# EAGLE design pcb-bldc-drive (EAGLE 9.6.2)
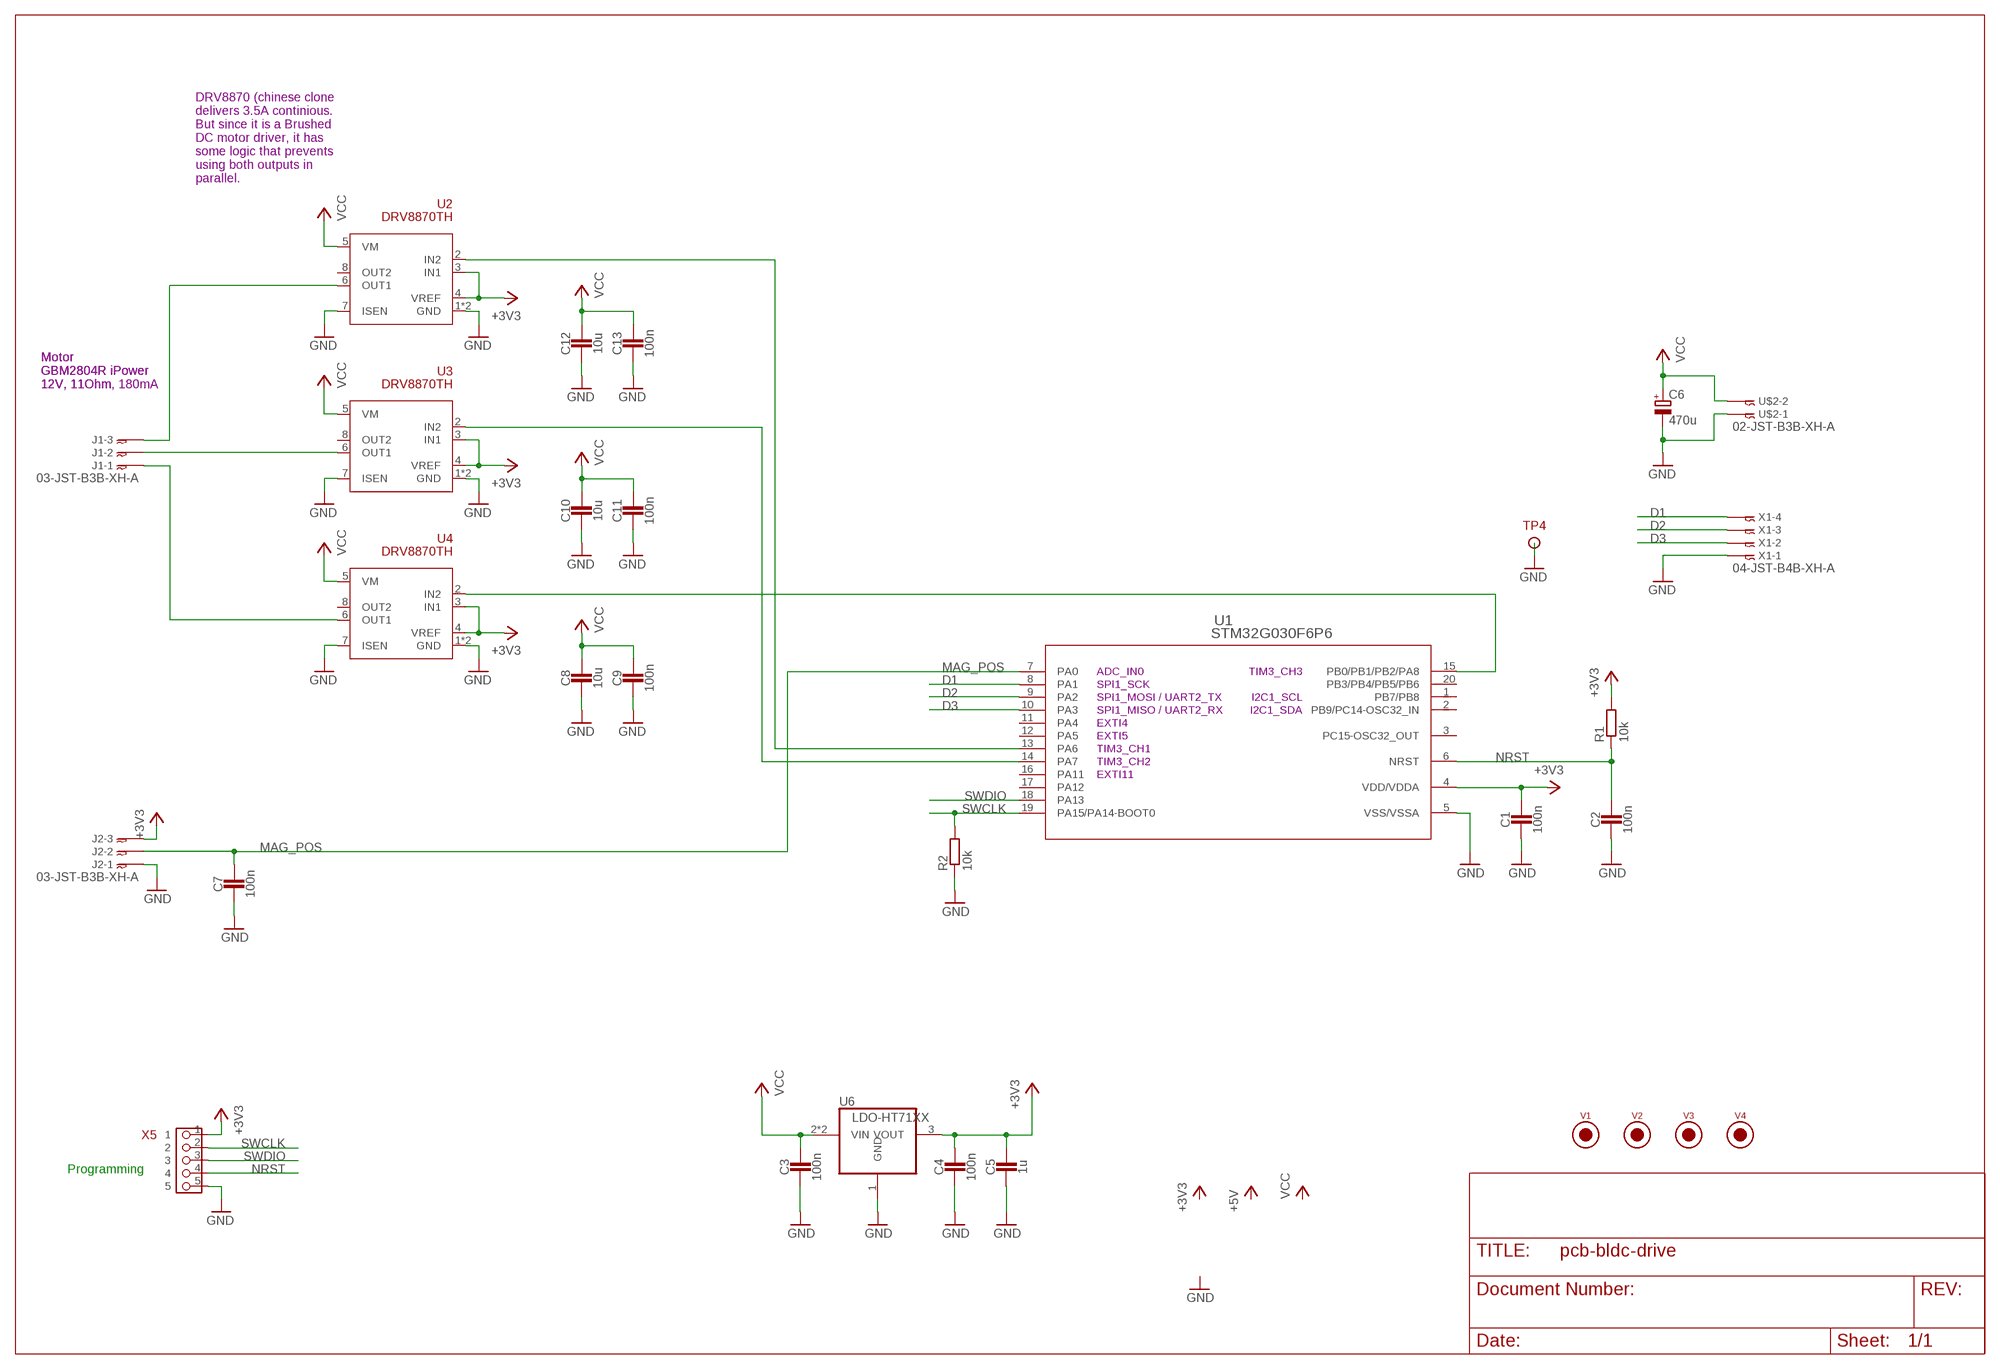
[diagram p0: schematic, sheet 1]

## Parts
C1  100n  CAPACITOR0603_CAP  [0603_CAP]
C2  100n  CAPACITOR0603_CAP  [0603_CAP]
C3  100n  CAPACITOR0603_CAP  [0603_CAP]
C4  100n  CAPACITOR0603_CAP  [0603_CAP]
C5  1u  CAPACITOR0603_CAP  [0603_CAP]
C6  470u  CPOL-EU153CLV-1010  [153CLV-1010]
C7  100n  CAPACITOR0603_CAP  [0603_CAP]
C8  10u  CAPACITOR1206_CAP  [1206_CAP]
C9  100n  CAPACITOR0603_CAP  [0603_CAP]
C10  10u  CAPACITOR1206_CAP  [1206_CAP]
C11  100n  CAPACITOR0603_CAP  [0603_CAP]
C12  10u  CAPACITOR1206_CAP  [1206_CAP]
C13  100n  CAPACITOR0603_CAP  [0603_CAP]
J1  03-JST-B3B-XH-A  [B3B-XH]
J2  03-JST-B3B-XH-A  [B3B-XH]
R1  10k  RESISTOR0603_RES  [0603-RES]
R2  10k  RESISTOR0603_RES  [0603-RES]
TP4  TESTPIN1MM  [PIN-SMD-1X1-TEST_1M0]
U1  STM32G030F6P6  [TSSOP20]
U2  DRV8870TH  [SOIC-8-THERM]
U3  DRV8870TH  [SOIC-8-THERM]
U4  DRV8870TH  [SOIC-8-THERM]
U6  LDO-HT71XX  [SOT-89]
U$2  02-JST-B3B-XH-A  [B2B-XH]
V1  FIDUCIAL2MM  [FIDUCIAL_2MM]
V2  FIDUCIAL2MM  [FIDUCIAL_2MM]
V3  FIDUCIAL2MM  [FIDUCIAL_2MM]
V4  FIDUCIAL2MM  [FIDUCIAL_2MM]
X1  04-JST-B4B-XH-A  [B4B-XH]
X5  PIN_5X1HD  [PIN_5X1_HD]

## Nets
+3V3: C1.1 C4.1 C5.1 J2.P$3 R1.2 U1.4(VDD/VDDA) U2.3(IN1) U2.4(VREF) U3.3(IN1) U3.4(VREF) U4.3(IN1) U4.4(VREF) U6.3(VOUT) X5.1
D1: U1.8(PA1) X1.P$4
D2: U1.9(PA2) X1.P$3
D3: U1.10(PA3) X1.P$2
GND: C1.2 C2.2 C3.2 C4.2 C5.2 C6.- C7.2 C8.2 C9.2 C10.2 C11.2 C12.2 C13.2 J2.P$1 R2.1 TP4.1 U1.5(VSS/VSSA) U2.1(GND) U2.7(ISEN) U2.9(GND) U3.1(GND) U3.7(ISEN) U3.9(GND) U4.1(GND) U4.7(ISEN) U4.9(GND) U6.1(GND) U$2.P$1 X1.P$1 X5.5
MAG_POS: C7.1 J2.P$2 U1.7(PA0)
N$3: J1.P$2 U3.6(OUT1)
N$4: J1.P$3 U2.6(OUT1)
N$5: U1.13(PA6) U2.2(IN2)
N$6: U1.14(PA7) U3.2(IN2)
N$7: J1.P$1 U4.6(OUT1)
N$9: U1.15(PB0/PB1/PB2/PA8) U4.2(IN2)
NRST: C2.1 R1.1 U1.6(NRST) X5.4
SWCLK: R2.2 U1.19(PA15/PA14-BOOT0) X5.2
SWDIO: U1.18(PA13) X5.3
VCC: C3.1 C6.+ C8.1 C9.1 C10.1 C11.1 C12.1 C13.1 U2.5(VM) U3.5(VM) U4.5(VM) U6.2(VIN) U6.2@1(VIN) U$2.P$2
Unconnected: U1.1(PB7/PB8) U1.2(PB9/PC14-OSC32_IN) U1.3(PC15-OSC32_OUT) U1.11(PA4) U1.12(PA5) U1.16(PA11) U1.17(PA12) U1.20(PB3/PB4/PB5/PB6) U2.8(OUT2) U3.8(OUT2) U4.8(OUT2)

## Notes on the sheet
- DRV8870 (chinese clone
  delivers 3.5A continious.
  But since it is a Brushed
  DC motor driver, it has
  some logic that prevents
  using both outputs in 
  parallel.
- Motor
  GBM2804R iPower
  12V, 11Ohm
- Motor
  GBM2804R iPower
  12V, 11Ohm, 180mA
- ADC_IN0 | TIM3_CH3
- SPI1_SCK
- SPI1_MOSI / UART2_TX | I2C1_SCL
- SPI1_MISO / UART2_RX | I2C1_SDA
- EXTI4
- EXTI5
- TIM3_CH1
- TIM3_CH2
- EXTI11
- Programming

## Library data of the parts
C1-C5 C7-C13 = passives:CAPACITOR: SMD Capacitor
C6 = resistor:CPOL-EU: POLARIZED CAPACITOR, European symbol
J1 J2 = bt_con-jst-xh:03-JST: JST CONNECTOR
R1 R2 = passives:RESISTOR: Resistor Basic schematic elements and footprints for 0201, 0402, 0603, 1206, and PTH resistors.
TP4 = ftobler_backup:TESTPIN
U1 = stm32:STM32G030F6P6; COPYRIGHT: Copyright (C) 2024 Ultra Librarian. All rights reserved.; MANUFACTURER_PART_NUMBER: STM32G030F6P6; MFR_NAME: STMicroelectronics
U2-U4 = ftobler:DRV8870
U6 = ftobler:LDO
U$2 = bt_con-jst-xh:02-JST: JST CONNECTOR
V1-V4 = ftobler - Copy:FIDUCIAL
X1 = bt_con-jst-xh:04-JST: JST CONNECTOR
X5 = ftobler-conn:PIN_5X1

## Board
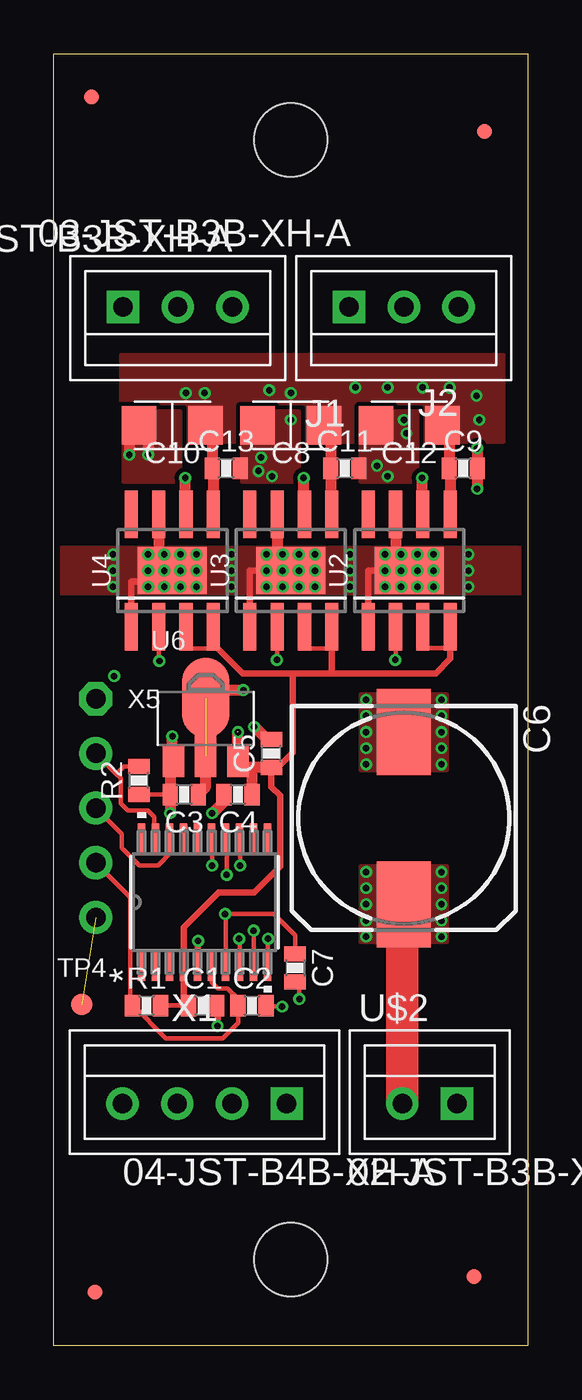
[diagram p1: board, top side]
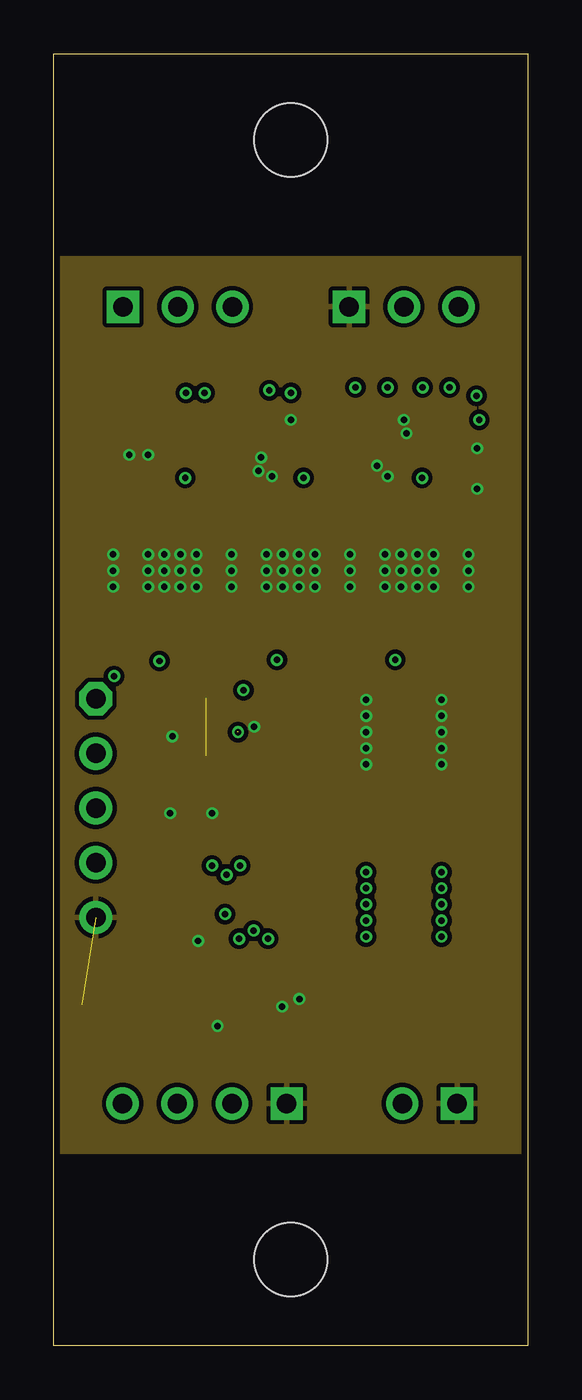
[diagram p2: board, inner layer Route2]
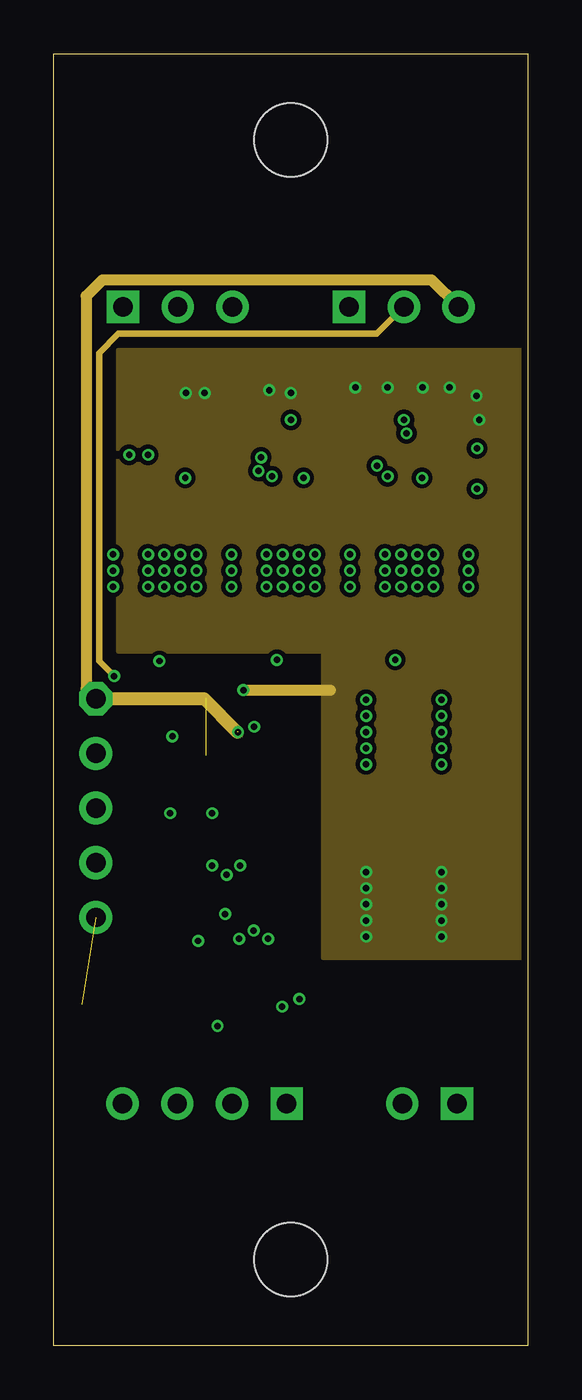
[diagram p3: board, inner layer Route15]
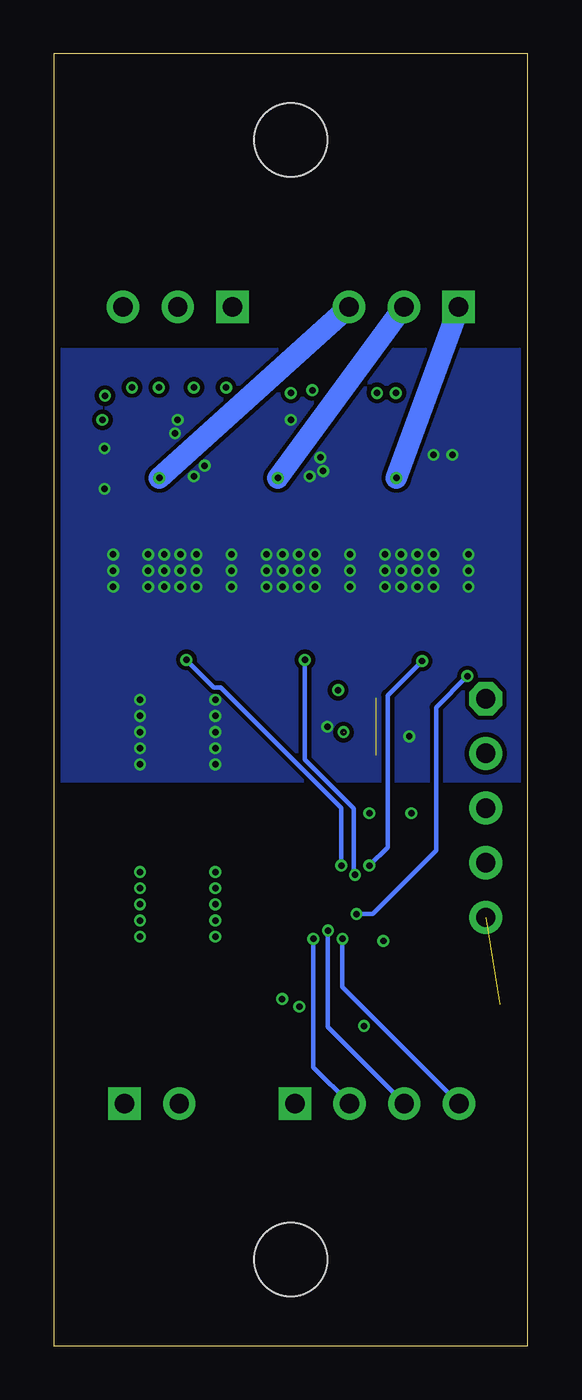
[diagram p4: board, bottom side, seen from below]

Size 22 x 60 mm. Coordinates in mm from the lower left corner, seen from the top.
Outline: 0,0 0,60 22,60 22,0 0,0
Copper layers (1+2*15+16): Top 0.035mm / dielectric 0.2mm / Route2 0.035mm / dielectric 0.4mm / Route15 0.035mm / dielectric 0.2mm / Bottom 0.035mm
Design rules "default *": minimum track width 0.15mm, minimum drill 0.2mm, track to track 0.2mm, track to pad 0.2mm, pad to pad 0.2mm, via to via 0.2mm, smd to smd 0.2mm, copper to edge 0.3mm, drill to drill 10mil, minimum pad ring 0.125mm, minimum via ring 0.125mm, stop-mask expansion 0.05mm, vias tented up to drill 0.35mm, thermal gap 0.2mm
Holes 3.4 mm at 11,56 11,4

### Footprints (pad centres in the part's own frame; a part is rotated, then mirrored left to right if it is on the bottom)
0603_CAP = smd 0.7 x 1: 1 -0.65,0; 2 0.65,0
153CLV-1010 = smd 4 x 2.5: + 4,0; - -4,0
1206_CAP = smd 1.6 x 1.8: 1 -1.55,0; 2 1.55,0
B3B-XH = drill 0.9 pad 1.5 square: P$1 2.54,0 | drill 0.9 pad 1.5: P$2 0,0; P$3 -2.54,0
0603-RES = smd 0.7 x 1: 1 -0.65,0; 2 0.65,0
PIN-SMD-1X1-TEST_1M0 = smd 1 x 1: 1 0,0
TSSOP20 = smd 1.462 x 0.355: 1 -2.921,2.925; 2 -2.921,2.275; 3 -2.921,1.625; 4 -2.921,0.975; 5 -2.921,0.325; 6 -2.921,-0.325; 7 -2.921,-0.975; 8 -2.921,-1.625; 9 -2.921,-2.275; 10 -2.921,-2.925; 11 2.921,-2.925; 12 2.921,-2.275; 13 2.921,-1.625; 14 2.921,-0.975; 15 2.921,-0.325; 16 2.921,0.325; 17 2.921,0.975; 18 2.921,1.625; 19 2.921,2.275; 20 2.921,2.925
SOIC-8-THERM = smd 0.61 x 2.21: 1 -1.905,-2.616; 2 -0.635,-2.616; 3 0.635,-2.616; 4 1.905,-2.616; 5 1.905,2.616; 6 0.635,2.616; 7 -0.635,2.616; 8 -1.905,2.616 | smd 3.2 x 2.2: 9 0,0
SOT-89 = smd 1 x 1.5: 1 -1.499,-1.981; 3 1.499,-1.981 | smd 1 x 2: 2 0,-1.727 | smd 2.2 x 3.7: 2@1 0,0.94
B2B-XH = drill 0.9 pad 1.5 square: P$1 1.27,0 | drill 0.9 pad 1.5: P$2 -1.27,0
FIDUCIAL_2MM = smd 0.7 x 0.7: V 0,0
B4B-XH = drill 0.9 pad 1.5 square: P$1 3.81,0 | drill 0.9 pad 1.5: P$2 1.27,0; P$3 -1.27,0; P$4 -3.81,0
PIN_5X1_HD = drill 0.9 pad 1.54 octagon: 1 0,0 | drill 0.9 pad 1.54: 2 0,-2.54; 3 0,-5.08; 4 0,-7.62; 5 0,-10.16

### Placement (x,y rotation side)
C1  6.9,15.8 0 top
C2  9.2,15.8 0 top
C3  6.05,25.6 180 top
C4  8.55,25.6 180 top
C5  10.1,27.5 90 top
C6  16.25,24.5 270 top
C7  11.2,17.55 270 top
C8  11,42.75 180 top
C9  19,40.75 0 top
C10  5.5,42.75 180 top
C11  13.5,40.75 0 top
C12  16.5,42.75 180 top
C13  8,40.75 0 top
J1  5.75,48.25 180 top
J2  16.25,48.25 180 top
R1  4.3,15.8 0 top
R2  3.95,26.25 90 top
TP4  1.3,15.85 0 top
U1  7,20.6 90 top
U2  16.5,36 0 top
U3  11,36 0 top
U4  5.5,36 0 top
U6  7.05,29.15 0 top
U$2  17.45,11.25 0 top
V1  1.75,58 0 top
V2  20,56.4 0 top
V3  19.5,3.2 0 top
V4  1.9,2.5 0 top
X1  7,11.25 0 top
X5  1.95,30.05 0 top

### Tracks (layer width: path | path; a pad name or v marks a point on that pad's centre or on a via)
+3V3  (via drill 0.3 pad 0.45)  (1 unrouted)
  Top 0.2: 6.13,32.38 6.12,32.38 | U4.4 7.41,32.38 6.13,32.38 | 6.13,32.38 U4.3 | U3.4 12.9,32.38 11.63,32.38 U3.3 | U2.3 17.14,32.66 17.4,32.4 18.15,32.4 18.41,32.66 18.41,33.25 | 6.03,16.02 C1.1 R1.2
  Top 0.3: U4.4 7.41,32.59 8.78,31.23 11.1,31.23 | U2.4 18.41,33.25 18.41,31.91 17.73,31.23 12.9,31.23 | 11.1,31.23 12.9,31.23 | U3.4 12.9,31.23 | 11.1,31.23 11.1,27.55 10.4,26.85 C5.1 10.1,25.95 10.5,25.55 10.5,22.25 9.3,21.05 7.65,21.05 6.03,19.43 U1.4 6.03,16.02
  Top 0.5: C5.1 8.87,26.85 | 8.87,26.85 U6.3 v8.55,28.5 | C4.1 9.2,26.52 8.87,26.85
  Route15 0.5: J2.P$3 17.54,49.5 2.25,49.5 1.5,48.75 1.5,30.5 X5.1
  Route15 0.6: X5.1 6.97,30.05 8.53,28.5
D1  (via drill 0.3 pad 0.45)
  Top 0.2: U1.8 8.62,18.88 v8.6,18.9
  Bottom 0.2: X1.P$4 7.03,15.09 8.6,16.66 v8.6,18.9
D2  (via drill 0.3 pad 0.45)
  Top 0.2: U1.9 v9.28,19.29
  Bottom 0.2: X1.P$3 9.28,14.79 v9.28,19.29
D3  (via drill 0.3 pad 0.45)
  Top 0.2: U1.10 9.93,18.88 v9.95,18.9
  Bottom 0.2: X1.P$2 9.95,12.93 v9.95,18.9
GND  (via drill 0.3 pad 0.45)  (1 unrouted)
  Top 0.2: 7.6,15.75 C1.2 | C2.2 9.9,15.75 v10.6,15.75 | R2.1 C3.2 | C7.2 11.4,16.7 v11.4,16.1
  Top 0.3: U4.1 3.6,35.5 5.5,35.5 U4.9 | U3.1 9.1,36 10.75,36 | U2.1 14.6,36 v16.12,36 | 7.6,15.75 v7.6,14.85 | U1.5 6.67,18.77 v6.7,18.8
  Top 0.5: v19.65,39.8 C9.2 v19.65,41.67 | C13.2 8.7,40.8 | U3.7 10.37,36.09 10.45,36 10.75,36 U3.9 | U4.7 4.87,36.63 U4.9 | U2.7 15.87,36.63 U2.9 | v4.38,41.38 4.38,42.75 C10.2 3.5,42.75 v3.5,41.38 | C5.2 9.9,28.15 v9.3,28.75 | C4.2 7.9,25.28 v7.35,24.73 | v5.4,24.73 C3.2 5.4,27.02 U6.1 5.5,27.22 v5.5,28.3
  other vias: 4.38,36.75 5.12,36.75 4.38,35.25 5.12,35.25 5.88,35.25 6.62,35.25 6.62,36 6.62,36.75 5.88,36 5.88,36.75 5.12,36 4.38,36 9.88,36.75 10.62,36.75 9.88,35.25 10.62,35.25 11.38,35.25 12.12,35.25 12.12,36 12.12,36.75 11.38,36 11.38,36.75 10.62,36 9.88,36 15.38,36.75 16.12,36.75 15.38,35.25 16.12,35.25 16.88,35.25 17.62,35.25 17.62,36 17.62,36.75 16.88,36 16.88,36.75 15.38,36 2.75,36.75 2.75,35.25 2.75,36 8.25,36.75 8.25,35.25 8.25,36 13.75,36.75 13.75,35.25 13.75,36 19.25,36.75 19.25,35.25 19.25,36 10.12,40.38 16.38,42.38 11,43 9.62,41.25 9.5,40.62 15,40.88 15.5,40.38 16.25,43 18,27 14.5,27.75 14.5,27 14.5,28.5 14.5,29.25 14.5,30 18,27.75 18,28.5 18,29.25 18,30
  pour Top (no thermals): -0.4,37.05 23.9,37.05 23.9,34.95 -0.4,34.95
  pour Top (no thermals): 8.75,42.88 8.75,40.12 10.62,40.12 11.38,40.12 11.38,43.38 8.75,43.38
  pour Top (no thermals): 14.25,42.88 14.25,40.12 16.12,40.12 16.88,40.12 16.88,43.38 14.25,43.38
  pour Top (no thermals): 3.25,42.88 3.25,40.12 5.12,40.12 5.88,40.12 5.88,43.38 3.25,43.38
  pour Route2: -1.25,50.5 24.5,50.5 24.5,9 -1.25,9
  pour Top (no thermals): 14.25,30.25 18.25,30.25 18.25,26.75 14.25,26.75
  pour Bottom: -0.75,46.25 25,46.25 25,40 25,26.25 -1.5,26.25 -1.5,46.25
MAG_POS  (via drill 0.3 pad 0.45)
  Top 0.2: C7.1 11.2,19.05 10.2,20.05 v7.95,20.05 7.97,20.02 U1.7
  Route15 0.3: J2.P$2 15,47 3,47 2.1,46.1 2.1,31.8 v2.8,31.1
  Bottom 0.2: v2.8,31.1 4.25,29.65 4.25,23 7.2,20.05 v7.95,20.05
N$3  (via drill 0.3 pad 0.45)
  Top 0.5: U3.6 v11.6,40.3
  Bottom 1: J1.P$2 v11.6,40.3
N$4  (via drill 0.3 pad 0.45)
  Top 0.5: U2.6 v17.1,40.3
  Bottom 1: J1.P$3 v17.1,40.3
N$5  (via drill 0.3 pad 0.45)
  Top 0.2: U2.2 15.87,31.86 v15.85,31.85 | U1.13 8.65,23.5 v8.65,22.3
  Bottom 0.2: v15.85,31.85 14.57,30.57 14.26,30.57 8.65,24.96 v8.65,22.3
N$6  (via drill 0.3 pad 0.45)
  Top 0.2: U3.2 10.37,31.86 v10.35,31.85 | U1.14 8.02,23.48 v8.02,21.87
  Bottom 0.2: v10.35,31.85 10.35,27.23 8.07,24.95 8.07,21.93 v8.02,21.87
N$7  (via drill 0.3 pad 0.45)
  Top 0.5: U4.6 v6.1,40.3
  Bottom 1: v6.1,40.3 3.21,48.2 J1.P$1
N$9  (via drill 0.3 pad 0.45)
  Top 0.2: U4.2 4.87,31.84 v4.9,31.8 | U1.15 7.35,23.5 v7.35,22.3
  Bottom 0.2: v4.9,31.8 6.5,30.2 6.5,23.15 v7.35,22.3
NRST
  Top 0.2: X5.4 3.55,20.83 3.55,15.9 R1.1 3.68,15.8 5.2,14.28 7.84,14.28 8.55,14.99 C2.1 8.55,16.1 8.05,16.6 7.6,16.6 7.33,16.88 U1.6
SWCLK
  Top 0.2: U1.19 4.65,23.6 4.65,24.55 4.35,24.85 3.43,24.85 3.1,25.18 3.1,26.36 2.9,26.55 | 2.9,26.55 X5.2 | R2.2 3.25,26.9 2.9,26.55
SWDIO
  Top 0.2: X5.3 3.15,23.77 3.15,23.11 3.96,22.3 4.84,22.3 5.44,22.9 5.45,22.9 5.45,23.45 U1.18
VCC  (via drill 0.3 pad 0.45)  (1 unrouted)
  Top 0.5: C10.1 7.35,42.45 C13.1 7.41,40.7 U4.5 | C8.1 12.85,42.45 C11.1 12.85,38.67 U3.5 | C12.1 18.35,42.45 C9.1 18.41,40.7 U2.5 | C3.1 7.05,25.95 U6.2 | U6.2@1 7.41,30.45 v8.8,30.45
  Top 1.5: U$2.P$2 16.18,20.7 16.1,20.7
  Route15 0.5: v8.8,30.45 12.85,30.45
  other vias: 6.12,44.25 7,44.25 10,44.38 11,44.25 14,44.5 15.5,44.5 17.12,44.5 18.38,44.5 19.75,43 19.62,44.12 18,19 14.5,19.75 14.5,19 14.5,20.5 14.5,21.25 14.5,22 18,19.75 18,20.5 18,21.25 18,22
  pour Top (rank 2, no thermals): 3.12,46 20.88,46 20.88,42 3.12,42
  pour Top (no thermals): 14.25,22.25 18.25,22.25 18.25,18.75 14.25,18.75
  pour Route15: 3,46.25 23,46.25 23,18 12.5,18 12.5,32.25 3,32.25

### Text on the board
tStop: V2 | V1 | V4 | V3 | GND | D4 | D5
tFinish: JLCJLCJLCJLC | 3 | C | D | R | G
bFinish: pcb-bldc-servo v2 / by ftobler 2024 | W | V | U | 3 | C | D | R | G | GND | VCC | GND | D1 | D2 | D3